# EAGLE design Pure LFO (EAGLE 9.6.2)

## Sheet 1 of 4
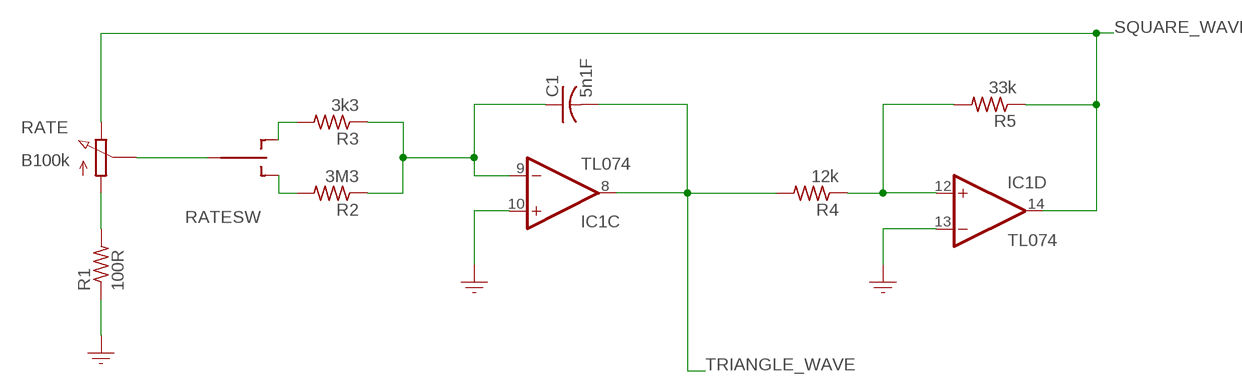
[diagram p0: schematic, sheet 1]

### Parts
C1  5n1F  CAPACITOR-USC0805  [C0805]
IC1  TL074  OPAMP_QUADD  [SO14]
R1  100R  RESISTOR_USR0805  [R0805]
R2  3M3  RESISTOR_USR0805  [R0805]
R3  3k3  RESISTOR_USR0805  [R0805]
R4  12k  RESISTOR_USR0805  [R0805]
R5  33k  RESISTOR_USR0805  [R0805]
RATE  B100k  RESISTOR_VARIABLE9MM_POT  [POTENTIOMETER_9MM]
RATESW  SWITCH_TOGGLE_SPDT  [TOGGLE_SW]

### Nets
GND: IC1.10(C:+IN) IC1.13(D:-IN) R1.1 ; also sheet 2,3,4
N$1: R1.2 RATE.P$1
N$2: RATE.P$2 RATESW.2(P)
N$3: R3.2 RATESW.1(O)
N$4: R2.2 RATESW.3(S)
N$6: C1.1 IC1.9(C:-IN) R2.1 R3.1
N$9: IC1.12(D:+IN) R4.1 R5.2
SQUARE_WAVE: IC1.14(D:OUT) R5.1 RATE.P$3 ; also sheet 3
TRIANGLE_WAVE: C1.2 IC1.8(C:OUT) R4.2 ; also sheet 2,3

## Sheet 2 of 4
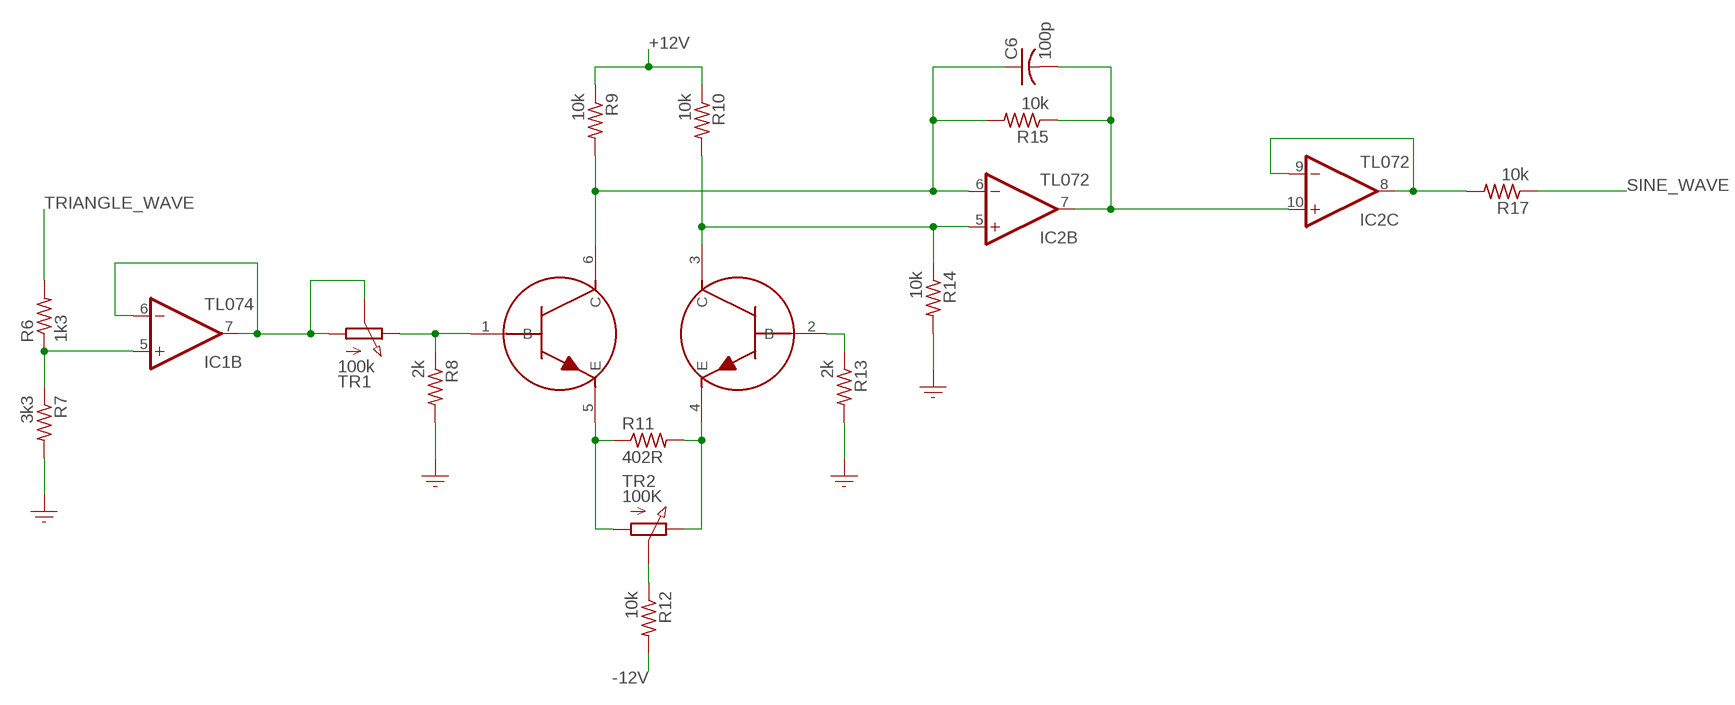
[diagram p1: schematic, sheet 2]

### Parts
C6  100p  CAPACITOR-USC0805  [C0805]
IC2  TL072  OPAMP_QUADD  [SO14]
R6  1k3  RESISTOR_USR0805  [R0805]
R7  3k3  RESISTOR_USR0805  [R0805]
R8  2k  RESISTOR_USR0805  [R0805]
R9  10k  RESISTOR_USR0805  [R0805]
R10  10k  RESISTOR_USR0805  [R0805]
R11  402R  RESISTOR_USR0805  [R0805]
R12  10k  RESISTOR_USR0805  [R0805]
R13  2k  RESISTOR_USR0805  [R0805]
R14  10k  RESISTOR_USR0805  [R0805]
R15  10k  RESISTOR_USR0805  [R0805]
R17  10k  RESISTOR_USR0805  [R0805]
T3  DMMT3904W-7-F  TRANSISTOR_PAIR_NPN  [TRANS_PAIR]
TR1  100k  RESISTOR_VARIABLETRIMMER_TH  [TRIMMER_TH]
TR2  100K  RESISTOR_VARIABLETRIMMER_TH  [TRIMMER_TH]

### Nets
+12V [Power]: R9.1 R10.1 ; also sheet 4
-12V [Power]: R12.2 ; also sheet 4
GND: R7.2 R8.2 R13.2 R14.2 ; also sheet 1,3,4
N$10: IC2.8(C:OUT) IC2.9(C:-IN) R17.2
N$21: R11.1 T3.5(E) TR2.1
N$25: R8.1 T3.1(B) TR1.3
N$26: R11.2 T3.4(E) TR2.3
N$27: R12.1 TR2.2
N$28: R13.1 T3.2(B)
N$32: C6.1 IC2.6(B:-IN) R9.2 R15.2 T3.6(C)
N$33: IC1.6(B:-IN) IC1.7(B:OUT) TR1.1 TR1.2
N$34: IC2.5(B:+IN) R10.2 R14.1 T3.3(C)
N$35: IC1.5(B:+IN) R6.1 R7.1
SINE_PRE: C6.2 IC2.7(B:OUT) IC2.10(C:+IN) R15.1
SINE_WAVE: R17.1 ; also sheet 3
TRIANGLE_WAVE: R6.2 ; also sheet 1,3

## Sheet 3 of 4
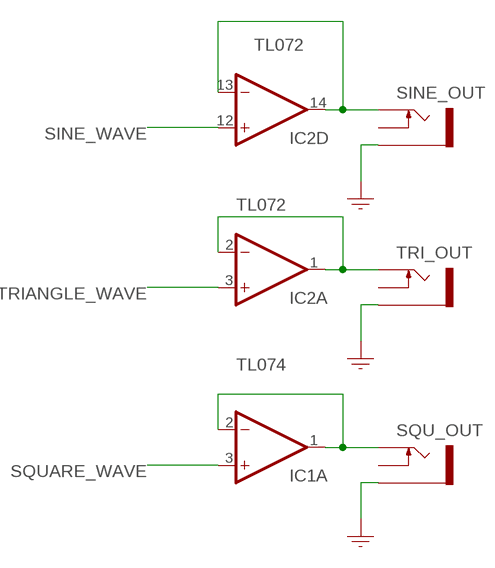
[diagram p2: schematic, sheet 3]

### Parts
SINE_OUT  SOCKET_MONO_3.5MMPJ301M-12  [PJ301M-12]
SQU_OUT  SOCKET_MONO_3.5MMPJ301M-12  [PJ301M-12]
TRI_OUT  SOCKET_MONO_3.5MMPJ301M-12  [PJ301M-12]

### Nets
GND: SINE_OUT.GND(SLEEVE) SQU_OUT.GND(SLEEVE) TRI_OUT.GND(SLEEVE) ; also sheet 1,2,4
N$5: IC1.1(A:OUT) IC1.2(A:-IN) SQU_OUT.TIP
N$7: IC2.1(A:OUT) IC2.2(A:-IN) TRI_OUT.TIP
N$8: IC2.13(D:-IN) IC2.14(D:OUT) SINE_OUT.TIP
SINE_WAVE: IC2.12(D:+IN) ; also sheet 2
SQUARE_WAVE: IC1.3(A:+IN) ; also sheet 1
TRIANGLE_WAVE: IC2.3(A:+IN) ; also sheet 1,2
Unconnected: SINE_OUT.NORM(SWITCH) SQU_OUT.NORM(SWITCH) TRI_OUT.NORM(SWITCH)

## Sheet 4 of 4
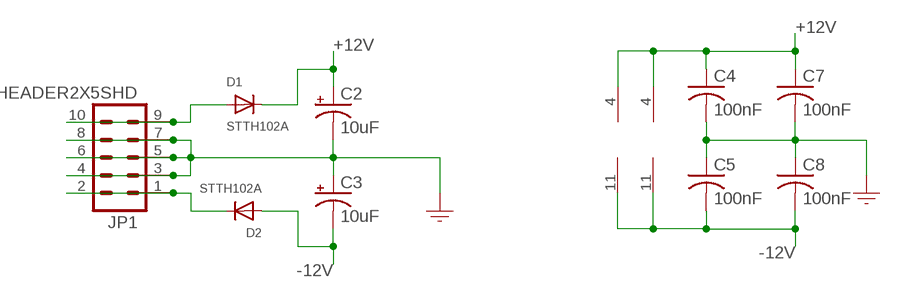
[diagram p3: schematic, sheet 4]

### Parts
C2  10uF  CAPACITOR_POL-US153CLV-0505  [153CLV-0505]
C3  10uF  CAPACITOR_POL-US153CLV-0505  [153CLV-0505]
C4  100nF  CAPACITOR-USC0805  [C0805]
C5  100nF  CAPACITOR-USC0805  [C0805]
C7  100nF  CAPACITOR-USC0805  [C0805]
C8  100nF  CAPACITOR-USC0805  [C0805]
D1  STTH102A  DIODESMA  [SMADIODE]
D2  STTH102A  DIODESMA  [SMADIODE]
JP1  HEADER2X5SHD  [2X5-SHROUDED]

### Nets
+12V [Power]: C2.+ C4.1 C7.1 D1.C IC1.4(P:V+) IC2.4(P:V+) ; also sheet 2
-12V [Power]: C3.- C5.2 C8.2 D2.A IC1.11(P:V-) IC2.11(P:V-) ; also sheet 2
GND: C2.- C3.+ C4.2 C5.1 C7.2 C8.1 JP1.3 JP1.4 JP1.5 JP1.6 JP1.7 JP1.8 ; also sheet 1,2,3
N$11: D1.A JP1.9 JP1.10
N$50: D2.C JP1.1 JP1.2

## Library data of the parts
C1 C4-C8 = GMSN:CAPACITOR-US: Capacitor; SORT: 3
C2 C3 = GMSN:CAPACITOR_POL-US: Electro Capacitor; SORT: 3
D1 D2 = GMSN:DIODE: Diode SMADIODE - SMA Surface Mount Package 20V 1A Schottky Diode Digikey: 641-1014-6-ND DO-1N4148 - Through Hole Small Current Diode SOD-123 20V 1 A (.5mV Vf) Schottky Diode - Digikey: MBRX120TPMSCT-ND SOD-323 10V 570mA (.38mV Vf, 3ns) Schottky Diode - Digikey: ZLLS410CT-ND SOD-523 30V 30mA Schottky Diode (RB751S-40TE61) - Digikey: RB751S-40TE61CT-ND SOT23-R/W - SOT23 Package (R = Solder Paste/Reflow Ovens, W = Hand-Soldering) BAT54Film 40V 300mA - Digikey: 497-7162-1-ND; SORT: 3.9
IC1 IC2 = GMSN:OPAMP_QUAD: OP AMP; SORT: 4.5
JP1 = GMSN:HEADER2X5: Header 5x2 Standard 10-pin dual row 0.1" header. Commonly used with AVR-ISP. Use with Spark Fun Electronics SKU: PRT-00778; SORT: 7
R1-R15 R17 = GMSN:RESISTOR_US: Resistor; SORT: 2
RATE = GMSN:RESISTOR_VARIABLE: Trimmer Pot; SORT: 8
RATESW = GMSN:SWITCH_TOGGLE_SPDT: On-Off-On Switch; SORT: 9
SINE_OUT SQU_OUT TRI_OUT = GMSN:SOCKET_MONO_3.5MM: 3.5 mm Jack Socket; SORT: 8
T3 = GMSN:TRANSISTOR_PAIR_NPN: NPN Transistor Matched Pair; SORT: 4
TR1 TR2 = GMSN:RESISTOR_VARIABLE: Trimmer Pot; SORT: 7

## Board
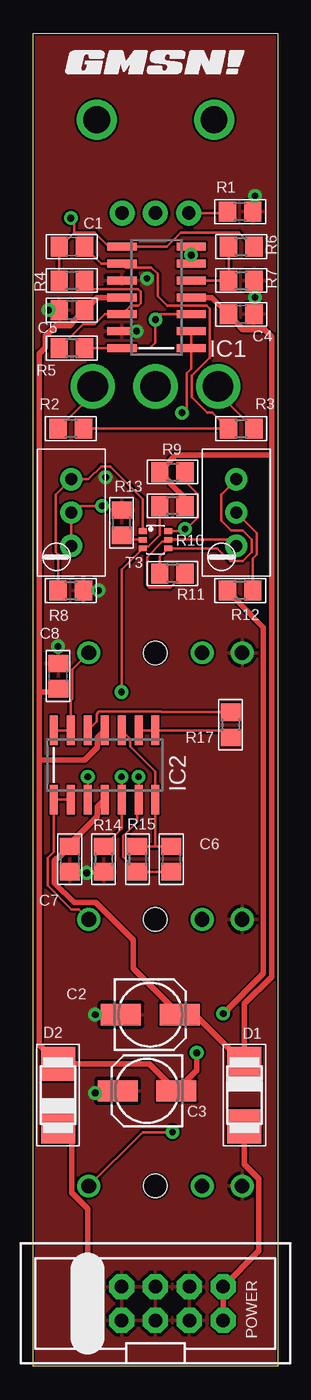
[diagram p4: board, top side]
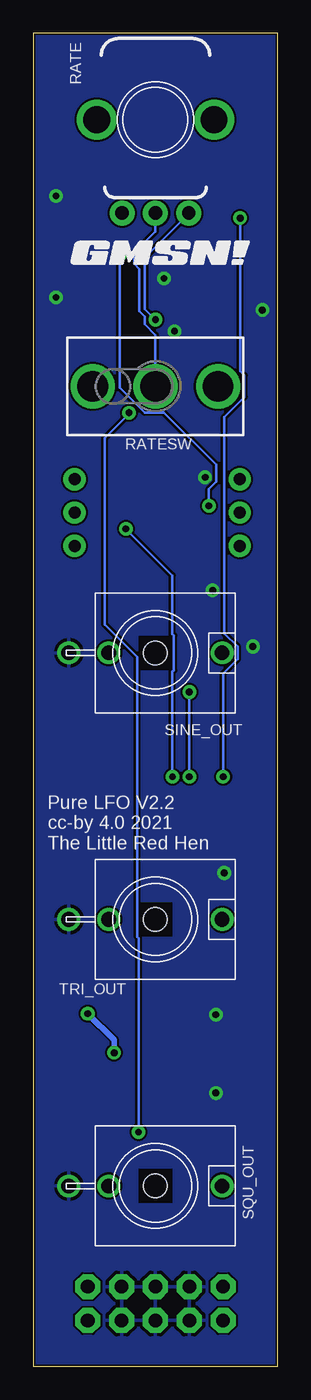
[diagram p5: board, bottom side, seen from below]

Size 18.32 x 100 mm. Coordinates in mm from the lower left corner, seen from the top.
Outline: 18.32,0 0,0 0,100 18.32,100 18.32,0
Copper layers (1*16): Top 0.035mm / dielectric 1.5mm / Bottom 0.035mm
Design rules "PCBWay": minimum track width 6mil, minimum drill 12mil, track to track 6mil, track to pad 6mil, pad to pad 6mil, via to via 6mil, smd to smd 6mil, copper to edge 6mil, drill to drill 6mil, minimum pad ring 12mil, minimum via ring 10mil, stop-mask expansion 4mil, vias tented up to drill 25mil, thermal gap 10mil

### Footprints (pad centres in the part's own frame; a part is rotated, then mirrored left to right if it is on the bottom)
C0805 = smd 1.3 x 1.5: 1 -0.95,0; 2 0.95,0
153CLV-0505 = smd 3 x 1.6: + 2.2,0; - -2.2,0
SMADIODE = smd 2.54 x 2.54: A 2.349,0; C -2.349,0
SO14 = smd 0.6 x 2.2: 1 -3.81,-2.6; 2 -2.54,-2.6; 3 -1.27,-2.6; 4 0,-2.6; 5 1.27,-2.6; 6 2.54,-2.6; 7 3.81,-2.6; 8 3.81,2.6; 9 2.54,2.6; 10 1.27,2.6; 11 0,2.6; 12 -1.27,2.6; 13 -2.54,2.6; 14 -3.81,2.6
2X5-SHROUDED = drill 1.016 pad 1.88 octagon: 1 -1.27,5.08; 2 1.27,5.08; 3 -1.27,2.54; 4 1.27,2.54; 5 -1.27,0; 6 1.27,0; 7 -1.27,-2.54; 8 1.27,-2.54; 9 -1.27,-5.08; 10 1.27,-5.08
R0805 = smd 1.3 x 1.5: 1 -0.95,0; 2 0.95,0
POTENTIOMETER_9MM = drill 1 pad 1.88: P$1 -2.5,-7; P$2 0,-7; P$3 2.5,-7 | drill 2 pad 2.68: P$4 -4.4,0; P$5 4.4,0
TOGGLE_SW = drill 2.3: 1 -4.7,0; 2 0,0; 3 4.7,0
PJ301M-12 = drill 1.1: GND 0,-6.5; NORM 0,-3.5; TIP 0,5 | hole 1.778: 0,0
TRANS_PAIR = smd 0.42 x 0.6: 1 -0.65,-0.95; 2 0,-0.95; 3 0.65,-0.95; 4 0.65,0.95; 5 0,0.95; 6 -0.65,0.95
TRIMMER_TH = drill 0.9 pad 1.676: 1 -0.802,1.143; 2 -3.302,1.143; 3 -5.802,1.143

### Placement (x,y rotation side)
C1  2.89,84 180 top
C2  8.76,26.37 0 top
C3  8.53,20.66 180 top
C4  15.59,78.92 0 top
C5  2.89,79.23 0 top
C6  10.35,38.04 90 top
C7  2.73,38.04 270 top
C8  1.86,51.77 270 top
D1  15.83,20.34 270 top
D2  1.86,20.34 90 top
IC1  9.24,80.19 90 top
IC2  5.35,45.1 0 top
JP1  9.16,4.7 90 top
R1  15.51,86.62 180 top
R2  2.81,70.34 180 top
R3  15.59,70.34 0 top
R4  2.89,81.46 180 top
R5  2.89,76.38 180 top
R6  15.59,84 0 top
R7  15.59,81.46 0 top
R8  2.81,58.2 0 top
R9  10.43,67.09 0 top
R10  10.43,64.55 180 top
R11  10.43,59.47 180 top
R12  15.51,58.2 180 top
R13  6.62,63.28 90 top
R14  5.27,38.04 270 top
R15  7.81,38.04 270 top
R17  14.8,48.12 270 top
RATE  9.16,93.52 0 bottom
RATESW  9.16,73.52 0 bottom
SINE_OUT  9.16,53.52 270 bottom
SQU_OUT  9.16,13.52 270 bottom
T3  9.16,62.01 270 top
TR1  1.7,60.74 270 top
TR2  14.08,60.74 270 top
TRI_OUT  9.16,33.52 270 bottom
U$1  [GMSN!_LOGO]  9.4,97.73 0 top
U$2  [GMSN!_LOGO]  8.53,83.44 0 bottom

### Tracks (layer width: path | path; a pad name or v marks a point on that pad's centre or on a via)
+12V
  Top 0.406: 17.86,68.36 17.86,77.25 17.35,77.76 15.72,77.76 15.48,78 15.48,78.07 C4.1 13.37,80.19 IC1.4 | 17.86,68.36 10.68,68.36 10.32,68.01 10.32,67.93 R9.1 10.32,66.25 10.32,66.17 11.38,65.11 R10.1 | IC2.4 4.79,41.94 4.79,41.23 2.73,39.18 C7.1 1.89,38.14 1.81,38.14 1.57,37.91 1.57,36.27 3.06,34.78 4.68,34.78 7.48,31.98 7.48,29.85 C2.+ 12.14,26.37 D1.C 15.83,27.18 17.86,29.21 17.86,68.36
-12V  (via drill 0.51)
  Top 0.406: 0.46,45.5 0.46,24.09 D2.A 8.69,22.69 C3.- 12.26,22.19 v12.26,23.51 | 0.46,45.5 0.46,50.58 | 0.46,50.58 0.46,75.98 0.88,76.41 0.88,77.3 1.67,78.08 2.76,78.08 3,78.32 3,78.39 C5.2 4.79,80.19 IC1.11 | C8.2 1.62,50.58 0.46,50.58 | R12.2 15.4,57.36 15.4,57.28 17.25,55.43 17.25,29.46 v14.24,26.45 | IC2.11 4.79,47.14 4.79,46.44 3.85,45.5 0.46,45.5
  Bottom 0.406: v14.24,26.45 12.26,24.47 v12.26,23.51
GND  (via drill 0.51)
  other vias: 16.62,80.19 16.62,87.81 8.53,81.62 7.73,77.65 1.14,79.23 5.43,66.69 4.87,58.2 1.86,53.99 4,37.01 4.64,26.37 4.64,20.5
  pour Top: 18.32,100 0,100 0,0 18.32,0
  pour Bottom: 18.32,100 0,100 0,0 18.32,0
N$1
  Top 0.203: R1.2 14.46,86.52 RATE.P$1
N$2
  Bottom 0.203: RATE.P$2 9.16,85.13 10.77,83.52 10.77,82.71 10.36,82.3 10.36,79.14 9.97,78.76 9.97,78.18 9.16,77.37 RATESW.2
N$3
  Top 0.203: R3.2 13.86,73.02 RATESW.1
N$4
  Top 0.203: R2.2 4.46,72.94 RATESW.3
N$5  (via drill 0.51)
  Top 0.203: IC1.2 IC1.1 11.84,74.85 11.49,74.5 11.49,71.88 v11.14,71.53 | SQU_OUT.TIP 8.2,17.56 v10.43,17.56
  Bottom 0.203: v10.43,17.56 10.43,32.11 10.53,32.21 10.53,53.22 12.97,55.66 12.97,69.63 11.11,71.49 v11.14,71.53
N$6
  Top 0.203: C1.1 5.11,82.73 IC1.9 6.94,82.43 8.86,82.43 9.34,81.95 9.34,80.28 10.04,79.58 13.01,79.58 13.24,79.34 13.24,75.68 11.9,74.33 11.9,72.71 13.05,71.56 13.43,71.56 R3.1 R2.1
N$7
  Top 0.203: IC2.2 IC2.1 1.54,38.59 1.07,38.12 1.07,36.06 2.85,34.27 3.41,34.27 TRI_OUT.TIP
N$8
  Top 0.203: IC2.14 IC2.13 2.81,49.94 2.91,50.04 2.91,52.27 SINE_OUT.TIP
N$9
  Top 0.203: R5.2 3.74,78.18 4.62,78.18 5.35,78.92 IC1.12 7.3,79.58 7.87,79.58 8.04,79.76 8.04,80.61 7.87,80.79 4.5,80.79 R4.1
N$10
  Top 0.203: IC2.9 IC2.8 14.26,47.7 R17.2
N$11
  Top 0.406: JP1.9 JP1.10 16.92,8.65 16.92,14.04 15.83,15.14 D1.A
N$21
  Top 0.203: TR2.1 14.76,62.01 T3.5 9.97,61.88 9.68,61.88 8.53,60.72 8.53,58.59 8.7,58.41 10.26,58.41 11.31,59.47 R11.1
N$25
  Top 0.203: T3.1 8.21,65.06 5.77,67.51 5.09,67.51 4.13,66.54 TR1.3 1.7,65.4 1.7,61.07 1.86,60.91 R8.1
N$26
  Top 0.203: R11.2 9.48,60.73 T3.4 13.79,61.36 14.75,60.4 15.7,60.4 16.37,61.07 16.37,62.02 15.7,62.69 14.84,62.69 14.08,63.44 14.08,65.4 TR2.3
N$27
  Top 0.203: R12.1 16.46,60.59 16.77,60.9 16.77,62.49 TR2.2
N$28
  Top 0.203: T3.2 6.94,62.01 R13.1
N$32  (via drill 0.51)
  Top 0.203: R9.2 11.38,66.38 12.34,65.43 12.34,63.67 11.48,62.82 v11.38,62.82 11.22,62.66 T3.6 | C6.1 R15.2 7.81,37.16 6.76,38.21 6.76,39.77 7.81,40.82 7.81,42.42 IC2.6 v7.89,44.23
  Bottom 0.203: v7.89,44.23 7.89,52.11 7.79,52.21 7.79,54.83 7.89,54.93 7.89,59.33 v11.38,62.82
N$33  (via drill 0.51)
  Top 0.203: IC1.6 v11.84,83.36 IC1.7 | TR1.1 TR1.2 3.35,64.55 v5.16,64.55
  Bottom 0.203: v5.16,64.55 5.16,65.81 4.62,66.36 4.62,67.63 8.55,71.56 9.97,71.56 11.84,73.42 v11.84,83.36
N$34  (via drill 0.51)
  Top 0.203: R10.2 9.48,62.34 8.64,61.49 8.35,61.49 T3.3 6.62,59.77 v6.62,50.58 | R14.1 6.62,40.34 IC2.5 v6.62,44.23
  Bottom 0.203: v6.62,44.23 v6.62,50.58
N$35
  Top 0.203: R6.1 R7.1 IC1.5
N$50
  Top 0.406: JP1.1 JP1.2 4.08,11.82 2.9,13 2.9,16.95 D2.C
SINE_PRE
  Top 0.203: R15.1 9.16,38.99 | 9.16,38.99 C6.2 | 9.16,38.99 IC2.7 9.16,44.6 7.29,46.48 7.29,47.04 IC2.10
SINE_WAVE
  Top 0.203: R17.1 9.62,49.07 9.59,49.11 6.62,49.11 6.19,49.11 4.92,49.11 4.75,48.93 4.75,48.37 IC2.12
SQUARE_WAVE  (via drill 0.51)
  Top 0.203: R5.1 IC1.14 8.74,76.38 9.16,76.8 v9.16,78.52 9.56,78.92 IC1.3
  Bottom 0.203: RATE.P$3 6.66,86.48 9.95,83.18 9.95,79.31 v9.16,78.52
TRIANGLE_WAVE  (via drill 0.51)
  Top 0.203: R4.2 C1.2 2.01,84 3.06,85.05 | 3.06,85.05 4.62,85.05 5.67,84 IC1.8 10.01,84 11.06,85.05 15.42,85.05 16.47,84 R6.2 | IC2.3 v4.08,44.23 | v2.81,86.14 3.06,85.89 3.06,85.05
  Bottom 0.203: v4.08,44.23 4.08,51.96 3,53.04 3,54 3.99,54.98 3.99,71.22 2.5,72.71 2.5,74.33 2.81,74.65 v2.81,86.14

### Text on the board
tPlace: T3 | POWER
bPlace: RATE | Pure LFO V2.2 / cc-by 4.0 2021 / The Little Red Hen